# Altium schematic sheet Digital Isolation.SchDoc
size A4
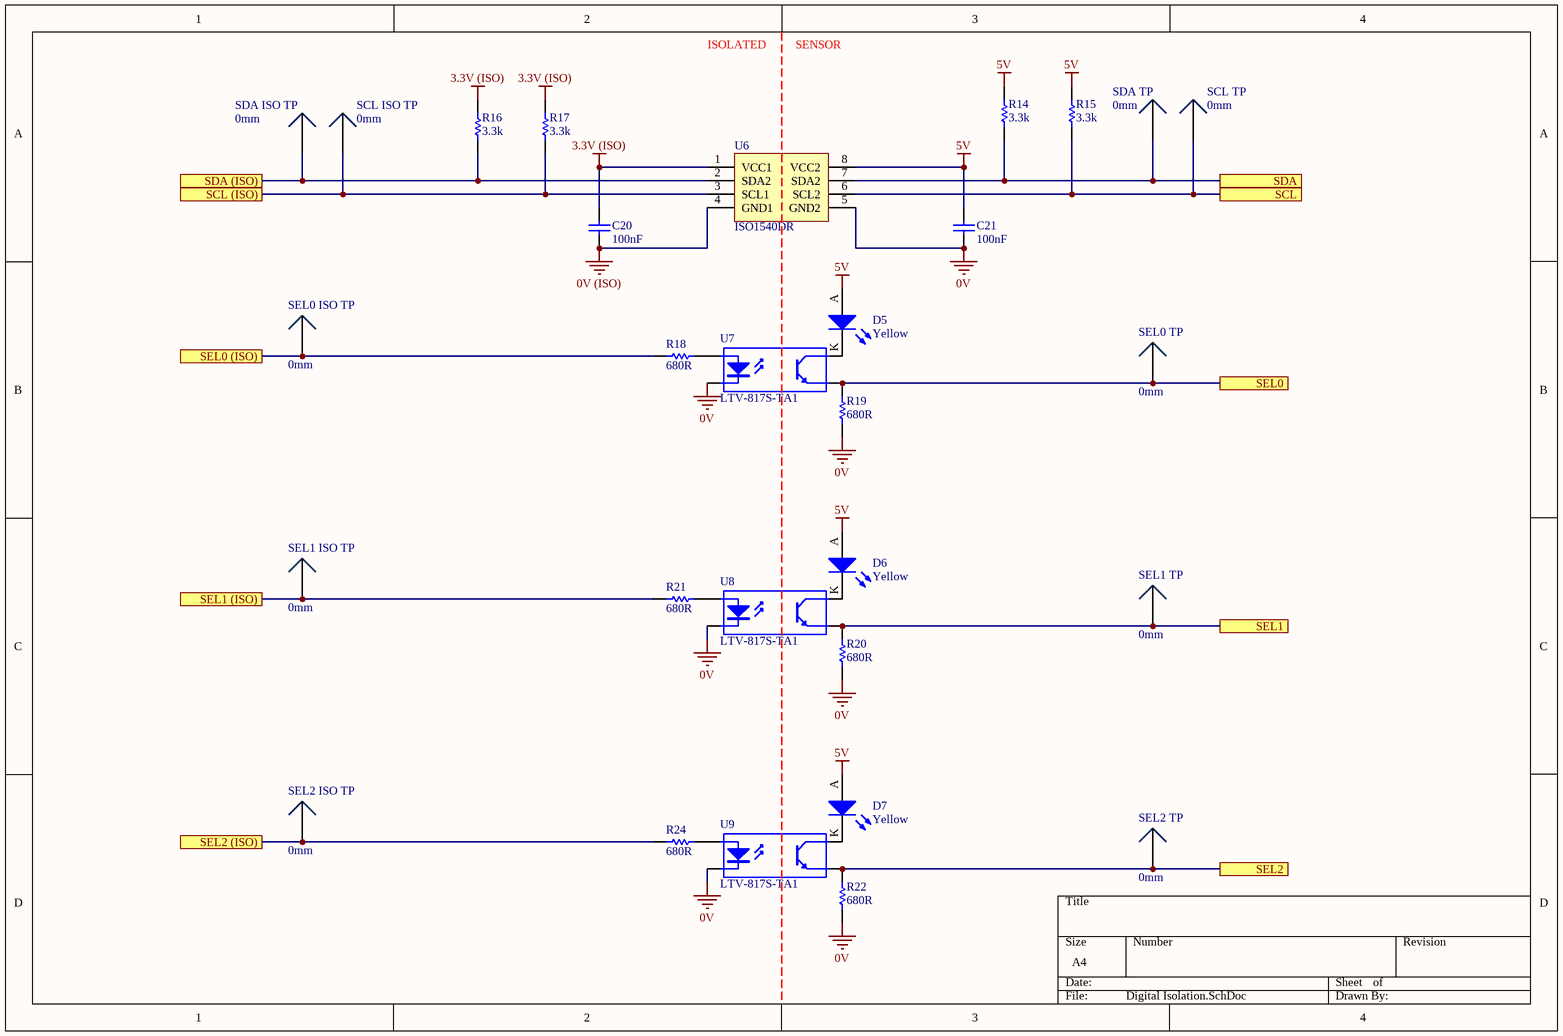
[diagram p0: Digital Isolation.SchDoc]

## Parts
C20  100nF  [0805]
C21  100nF  [0805]
D5  Yellow  [0805 LED]
D6  Yellow  [0805 LED]
D7  Yellow  [0805 LED]
R14  3.3k  [0805]
R15  3.3k  [0805]
R16  3.3k  [0805]
R17  3.3k  [0805]
R18  680R  [0805]
R19  680R  [0805]
R20  680R  [0805]
R21  680R  [0805]
R22  680R  [0805]
R24  680R  [0805]
SCL_ISO_TP  0mm  [SMD Test Point]
SCL_TP  0mm  [SMD Test Point]
SDA_ISO_TP  0mm  [SMD Test Point]
SDA_TP  0mm  [SMD Test Point]
SEL0_ISO_TP  0mm  [SMD Test Point]
SEL0_TP  0mm  [SMD Test Point]
SEL1_ISO_TP  0mm  [SMD Test Point]
SEL1_TP  0mm  [SMD Test Point]
SEL2_ISO_TP  0mm  [SMD Test Point]
SEL2_TP  0mm  [SMD Test Point]
U6  ISO1540DR  [TI 8-SOIC]
U7  LTV-817S-TA1  [ON 4-SMD]
U8  LTV-817S-TA1  [ON 4-SMD]
U9  LTV-817S-TA1  [ON 4-SMD]

## Ports
SCL, SCL (ISO), SDA, SDA (ISO), SEL0, SEL0 (ISO), SEL1, SEL1 (ISO), SEL2, SEL2 (ISO)

## Nets
0V: C21.1 R19.1 R20.1 R22.1 U6.5(GND2) U7.2(K) U8.2(K) U9.2(K)
0V (ISO): C20.1 U6.4(GND1)
3.3V (ISO): C20.2 R16.2 R17.2 U6.1(VCC1)
5V: C21.2 D5.A D6.A D7.A R14.2 R15.2 U6.8(VCC2)
SCL: R15.1 SCL_TP.1 U6.6(SCL2) ; port SCL
SCL (ISO): R17.1 SCL_ISO_TP.1 U6.3(SCL1) ; port SCL (ISO)
SDA: R14.1 SDA_TP.1 U6.7(SDA2) ; port SDA
SDA (ISO): R16.1 SDA_ISO_TP.1 U6.2(SDA2) ; port SDA (ISO)
SEL0: R19.2 SEL0_TP.1 U7.3(E) ; port SEL0
SEL0 (ISO): R18.1 SEL0_ISO_TP.1 ; port SEL0 (ISO)
SEL1: R20.2 SEL1_TP.1 U8.3(E) ; port SEL1
SEL1 (ISO): R21.1 SEL1_ISO_TP.1 ; port SEL1 (ISO)
SEL2: R22.2 SEL2_TP.1 U9.3(E) ; port SEL2
SEL2 (ISO): R24.1 SEL2_ISO_TP.1 ; port SEL2 (ISO)
NetD5_K: D5.K U7.4(C)
NetD6_K: D6.K U8.4(C)
NetD7_K: D7.K U9.4(C)
NetR18_2: R18.2 U7.1(A)
NetR21_2: R21.2 U8.1(A)
NetR24_2: R24.2 U9.1(A)

## Notes on the sheet
- ISOLATED
- SENSOR

## Library data of the parts
C20 C21 = GCM21BR71E104KA37L: Manufacturer: muRata; Tolerance: 10%; Material: X7R; Rated Voltage: 25V; Part Number: GCM21BR71E104KA37L; Value: 100nF
D5-D7 = SML-211YTT86: Yellow LED Indication - Discrete 1.75V 0805 (2012 Metric); Manufacturer: ROHM Semiconductor; Part Number: SML-211YTT86; Colour: Yellow; Digikey Part Number: 511-1293-1-ND; Digikey Link: https://www.digikey.com/product-detail/en/rohm-semiconductor/SML-211YTT86/511-1293-1-ND/637106
R14-R17 = RC0805FR073K3L: Manufacturer: YAGEO; Tolerance: 0.01; Rated Voltage: 0.125W; Part Number: RC0805FR073K3L; Value: 3.3k; Material: FR-07
R18-R22 R24 = RC0805FR07680RL: Manufacturer: YAGEO; Tolerance: 0.01; Rated Voltage: 0.125W; Part Number: RC0805FR07680RL; Value: 680R; Material: FR-07
SCL_ISO_TP SCL_TP SDA_ISO_TP SDA_TP SEL0_ISO_TP SEL0_TP SEL1_ISO_TP SEL1_TP SEL2_ISO_TP SEL2_TP = SMD Test Point: Positions: 1; Row Spacing: 0; Flange: No; Contact: NA; Part Number: SMD Test Point; Pitch: 0mm; Angle: 0
U6 = ISO1540DR: I2C Digital Isolator (Multichannel); Manufacturer: Texas Instruments; Part Number: ISO1540DR; Digikey Part Number: 296-34871-1-ND; Digikey Link: https://www.digikey.com/product-detail/en/texas-instruments/ISO1540DR/296-34871-1-ND/3587214
U7-U9 = LTV-817S-TA1: 35V 50ma Optocoupler (VF=1.2V); Manufacturer: Lite-On Inc; Part Number: LTV-817S-TA1; Digikey Part Number: 160-1893-2-ND; Digikey Link: https://www.digikey.com/product-detail/en/lite-on-inc/LTV-817S-TA1/160-1893-2-ND/388451